# Altium schematic sheet Schemat_JD.SchDoc
size A4
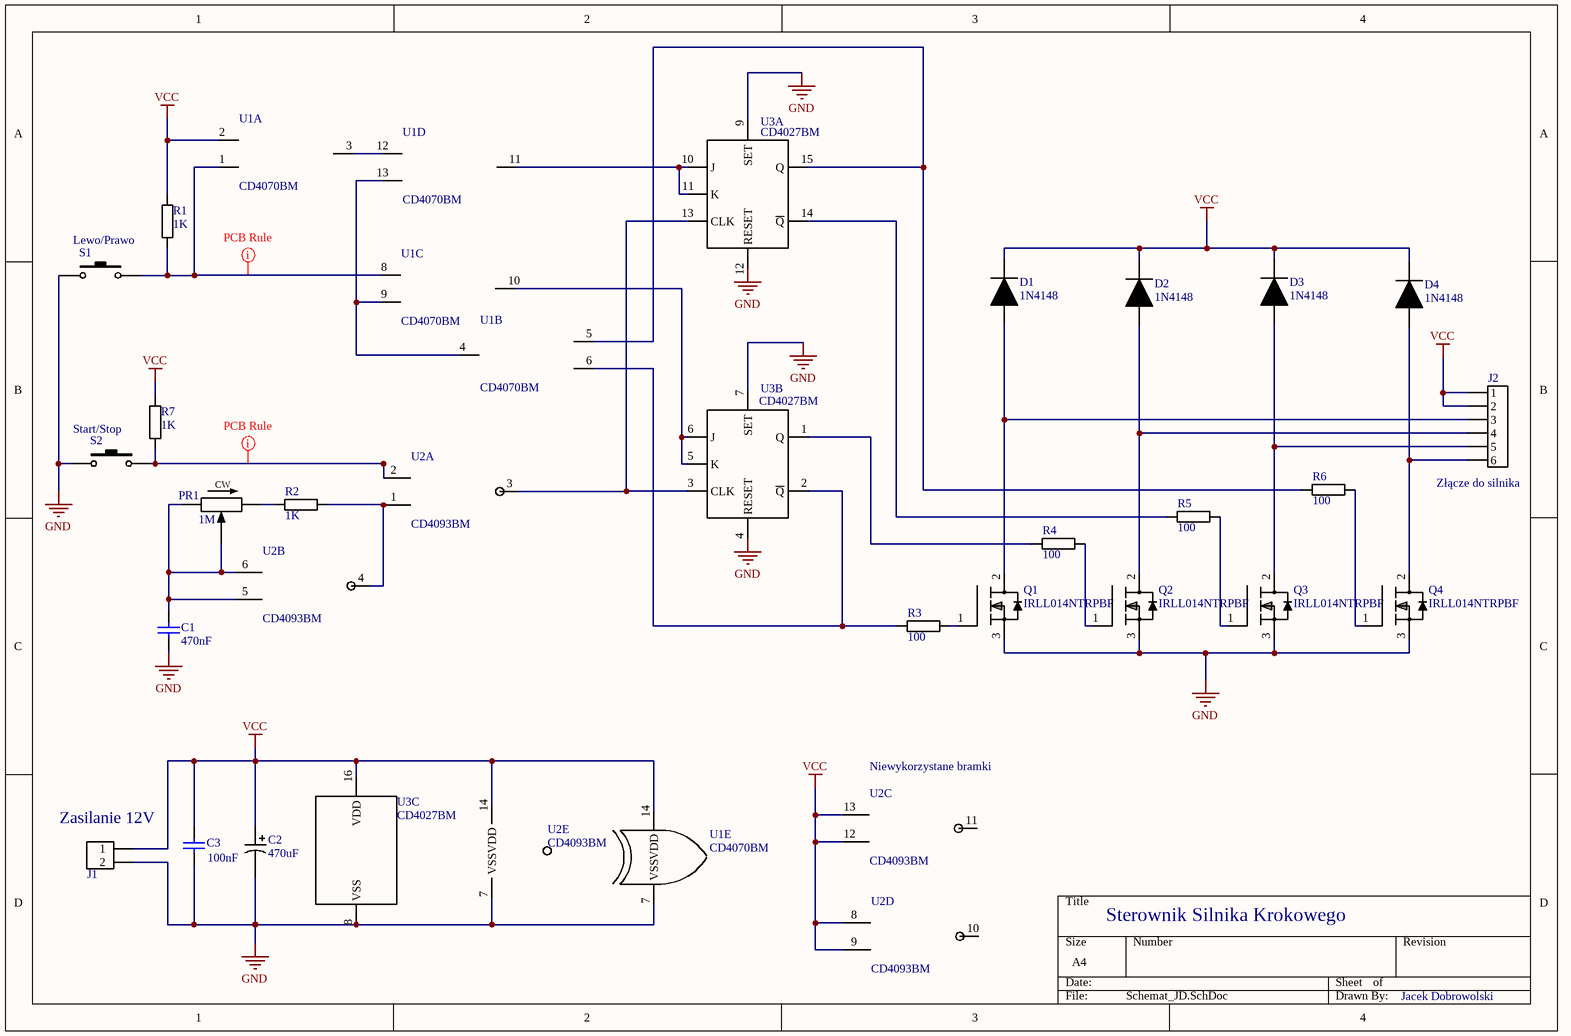
[diagram p0: Schemat_JD.SchDoc]

## Parts
C1  value 470nF  [R0603_JD]  (hidden comment: Cap Semi)
C2  value 470uF  [POL_CAP_JD]  (hidden comment: ELECTROLYTIC_CAP_JD)
C3  value 100nF  [R0603_JD]  (hidden comment: Cap Semi)
D1  1N4148  [D0603_JD]
D2  1N4148  [D0603_JD]
D3  1N4148  [D0603_JD]
D4  1N4148  [D0603_JD]
J1  ARK_2.54  [ARK_DG308-2.54x2_JD]  (value not drawn)
J2  GOLDPIN_HEADER  [GOLDPINx6_JD]  (value not drawn)
PR1  value 1M  [J_VISHAY_JD]  (hidden comment: TRIMPOT)
Q1  IRLL014NTRPBF  [SOT223_JD]
Q2  IRLL014NTRPBF  [SOT223_JD]
Q3  IRLL014NTRPBF  [SOT223_JD]
Q4  IRLL014NTRPBF  [SOT223_JD]
R1  value 1K  [R0603_JD]  (hidden comment: RES_JD)
R2  value 1K  [R0603_JD]  (hidden comment: RES_JD)
R3  value 100  [R0603_JD]  (hidden comment: RES_JD)
R4  value 100  [R0603_JD]  (hidden comment: RES_JD)
R5  value 100  [R0603_JD]  (hidden comment: RES_JD)
R6  value 100  [R0603_JD]  (hidden comment: RES_JD)
R7  value 1K  [R0603_JD]  (hidden comment: RES_JD)
S1  SWITCH_JD  [SPST_JD]  (value not drawn)
S2  SWITCH_JD  [SPST_JD]  (value not drawn)
U1  CD4070BM  [SO14_JD]  (parts A,B,C,D,E of 5)
U2  CD4093BM  [SO14_JD]  (parts A,B,C,D,E of 5)
U3  CD4027BM  [SO16_JD]  (parts A,B,C of 3)

## Nets
GND: C1.1 C2.2 C3.1 J1.2 Q1.3(S) Q2.3(S) Q3.3(S) Q4.3(S) S1.1 S2.1 U1.7(VSS) U2.7(VSS) U3.4(RESET) U3.7(SET) U3.8(VSS) U3.9(SET) U3.12(RESET)
VCC: C2.1 C3.2 D1.K(Katode) D2.K(Katode) D3.K(Katode) D4.K(Katode) J1.1 J2.1 J2.2 R1.2 R7.2 U1.2(A) U1.14(VDD) U2.8(E) U2.9(F) U2.12(G) U2.13(H) U2.14(VDD) U3.16(VDD)
NetC1_2: C1.2 PR1.1 PR1.2 U2.5(C) U2.6(D)
NetD1_A: D1.A(Anode) J2.3 Q1.2(D)
NetD2_A: D2.A(Anode) J2.4 Q2.2(D)
NetD3_A: D3.A(Anode) J2.5 Q3.2(D)
NetD4_A: D4.A(Anode) J2.6 Q4.2(D)
NetPR1_3: PR1.3 R2.1
NetQ1_1: Q1.1(G) R3.2
NetQ2_1: Q2.1(G) R4.2
NetQ3_1: Q3.1(G) R5.2
NetQ4_1: Q4.1(G) R6.2
NetR1_1: R1.1 S1.3 U1.1(A) U1.8(E)
NetR2_2: R2.2 U2.1(A) U2.4(K)
NetR3_1: R3.1 U1.6(D) U3.2(~{Q})
NetR4_1: R4.1 U3.1(Q)
NetR5_1: R5.1 U3.14(~{Q})
NetR6_1: R6.1 U1.5(C) U3.15(Q)
NetR7_1: R7.1 S2.3 U2.2(B)
NetU1_3: U1.3(J) U1.12(G)
NetU1_4: U1.4(K) U1.9(F) U1.13(H)
NetU1_10: U1.10(L) U3.5(K) U3.6(J)
NetU1_11: U1.11(M) U3.10(J) U3.11(K)
NetU2_3: U2.3(J) U3.3(CLK) U3.13(CLK)

Not connected (* = marked no-connect by the designer): U2 10(L) 11(M)

## Layout directives
rule Width Constraint [Pref Width = 10mil    Min Width = 10mil    Max Width = 60mil]: NetR1_1
rule Width Constraint [Pref Width = 10mil    Min Width = 10mil    Max Width = 50mil]: NetR7_1

## Notes on the sheet
- Lewo/Prawo
- Start/Stop
- (near J2) Złącze do silnika
- (near U2) Niewykorzystane bramki
- Zasilanie 12V
- Sterownik Silnika Krokowego
- Jacek Dobrowolski
- (in symbol POT_TS53J_JD) CW

## Library data of the parts
C1 C3 = Cap Semi: Capacitor (Semiconductor SIM Model); Published: 8-Jun-2000; LatestRevisionDate: 29-May-2009; LatestRevisionNote: IPC-7351 Footprint Added.; PackageReference: C1206; Publisher: Altium Limited; PackageDescription: Chip Capacitor
D1-D4 = 1N4148_JD: MAX POWER: 500mW; MAX CURRENT: 150mA; Supplier 1: TME; Supplier Part Number 1: 1N4148-1206; helpURL: https://www.tme.eu/Document/8a0f4bd1d0e0495ebb1834ba060fbfa0/CD4148.pdf
J1 = ARK2_2.54_JD: MAX Current: 6A; MAX Voltage: 150; Supplier 1: TME; Supplier Part Number 1: DG308-2.54-02P; helpURL: https://www.tme.eu/Document/e399f683de63f8ff6d8fcb1baa663eaf/DG308-2.54.pdf
J2 = GOLDPIN_JD: helpURL: https://www.tme.eu/Document/719e00d14e261a014e3a7e1c938a6b50/77311-818-XXLF.pdf; Supplier 1: TME; Supplier Part Number 1: 77311-818-06LF
PR1 = POT_TS53J_JD: RATED POWER: 0.25W; Supplier 1: TME; Supplier Part Number 1: TS53YJ1M; helpURL: https://www.tme.eu/Document/214820d8bf228e416b0cbb84d9c6ed07/ts53yj.pdf
Q1-Q4 = IRLL014NTRPBF_JD: Drain Current: 2A; MAX POWER: 2.1W; Supplier 1: TME; Supplier Part Number 1: IRLL014NTRPBF
R1-R7 = RES_JD: Resistor; Published: 8-Jun-2000; LatestRevisionDate: 17-Jul-2002; LatestRevisionNote: Re-released for DXP Platform.; PackageReference: AXIAL-0.4; Publisher: Altium Limited; PackageDescription: Axial Device, Thru-Hole; 2 Leads; 0.4 in Pin Spacing; helpURL: https://www.tme.eu/Document/9e42ba54d36a9bd3dfa2901986ac022d/rezystor-smd.pdf; Supplier 1: TME; Supplier Part Number 1: 0603SAF1000T5E
S1 S2 = SWITCH_JD: Switch; Published: 24-Mar-1999; LatestRevisionDate: 17-Jul-2002; LatestRevisionNote: Re-released for DXP Platform.; PackageReference: SPST-2; Publisher: Altium Limited; PackageDescription: Switch; 2 Leads; Supplier 1: TME; Supplier Part Number 1: B3F-4055
U1 = CD4070BM_XOR_JD: helpURL: http://www.ti.com/lit/ds/symlink/cd4077b.pdf; Supplier 1: TME; Supplier Part Number 1: CD4070BM; CASE: SO14
U2 = CD4093BM_SCHMITT_JD: Supplier 1: TME; Supplier Part Number 1: CD4093BM; helpURL: https://www.ti.com/lit/ds/symlink/cd4093b.pdf
U3 = CD4027BM_JKFF_JD: Supplier 1: TME; Supplier Part Number 1: CD4027BM; CASE: SOP16; helpURL: https://www.ti.com/lit/ds/symlink/cd4027b-mil.pdf
C2 = ELECTROLYTIC_CAP_JD: Published: 8-Jun-2000; LatestRevisionDate: 17-Jul-2002; LatestRevisionNote: Re-released for DXP Platform.; PackageReference: POLAR0.8; Publisher: Altium Limited; PackageDescription: Polarized Capacitor; 2 Leads; Supplier 1: TME; Supplier Part Number 1: EEEFP1C471AP